# Altium schematic sheet MTP125-1106S1_2021-01-09.schdoc
size 39 x 40 mm
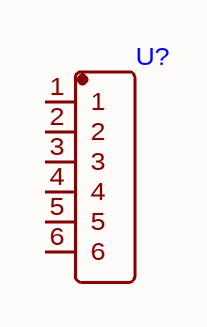
[diagram p0: MTP125-1106S1_2021-01-09.schdoc]

## Parts
U?  (no value)  [HDR-TH_6P-P2.54-V]

## Nets

Not connected (* = marked no-connect by the designer): U? 1 2 3 4 5 6

## Library data of the parts
U? = MTP125-1106S1